# Altium schematic sheet ATMEGA2560-Schematic.SchDoc
size A
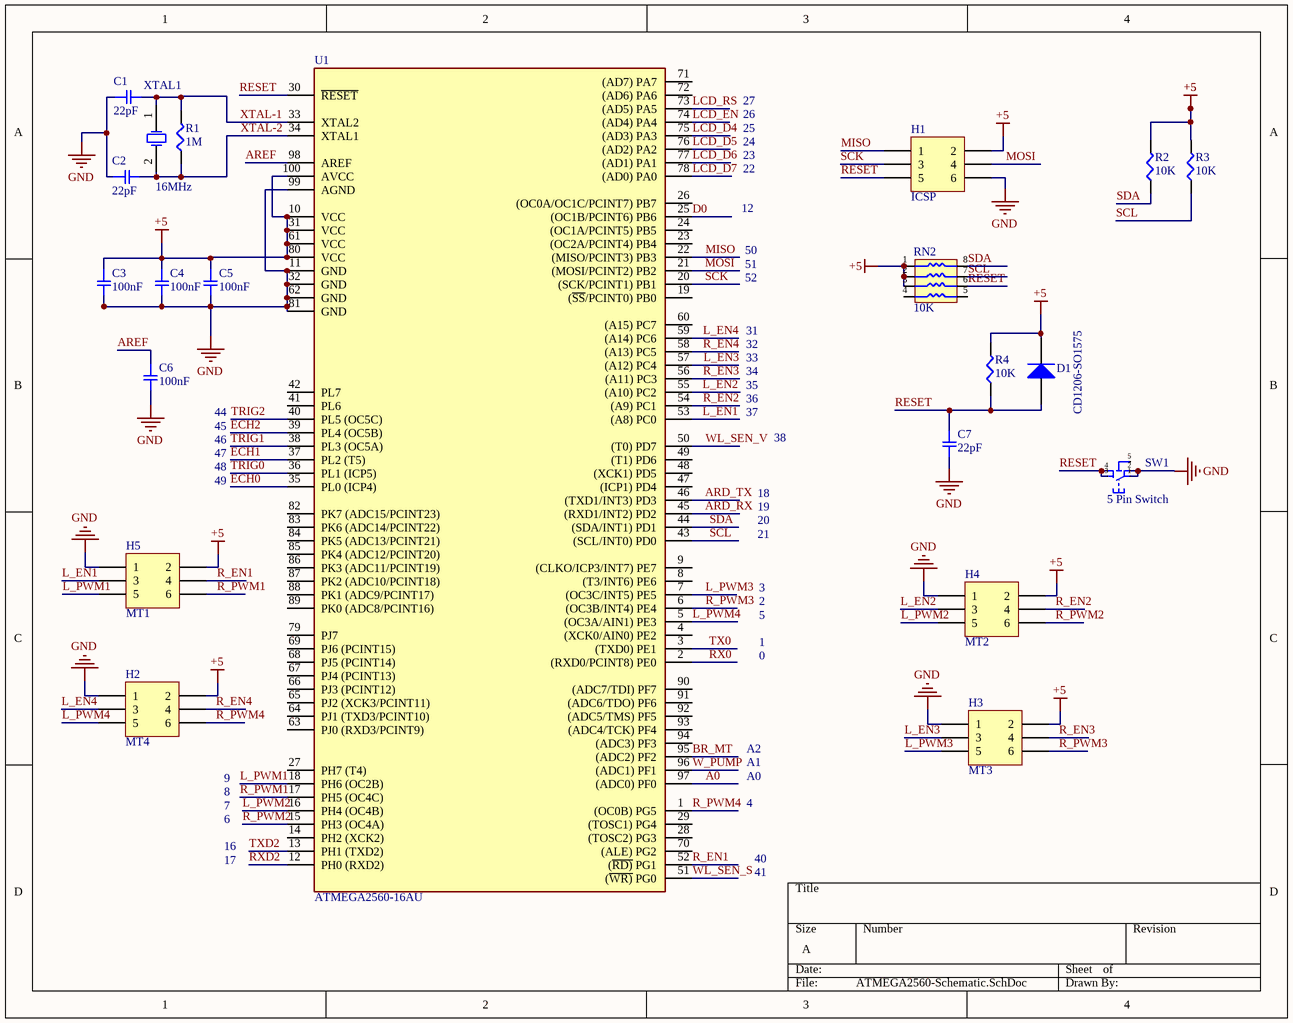
[diagram p0: ATMEGA2560-Schematic.SchDoc]

## Parts
C1  22pF
C2  22pF
C3  100nF  [SMD-0805C]
C4  100nF  [SMD-0805C]
C5  100nF  [SMD-0805C]
C6  100nF  [SMD-0805C]
C7  22pF  [SMD-0603C]
D1  CD1206-SO1575  [D1206-RD]
H1  ICSP  [HDR2X3]
H2  MT4  [HDR2X3]
H3  MT3  [HDR2X3]
H4  MT2  [HDR2X3]
H5  MT1  [HDR2X3]
R1  1M  [SMD-0805-RES]
R2  10K
R3  10K
R4  10K
RN2  10K  [RA0603-8]
SW1  5 Pin Switch  [SPDT-5Pin]
U1  ATMEGA2560-16AU  [TQFP-100(LCSC)]
XTAL1  16MHz

## Nets
+5: C3.1 C4.1 C5.1 D1.2(K) H1.2 H2.2 H3.2 H4.2 H5.2 R2.2 R3.2 R4.2 RN2.1 RN2.2 RN2.3 U1.10(VCC) U1.31(VCC) U1.61(VCC) U1.80(VCC) U1.100(AVCC)
GND: C1.1 C2.1 C3.2 C4.2 C5.2 C6.2 C7.2 H1.6 H2.1 H3.1 H4.1 H5.1 SW1.1 SW1.2 U1.11(GND) U1.32(GND) U1.62(GND) U1.81(GND) U1.99(AGND)
A0: U1.97((ADC0)_PF0)
ARD_RX: U1.45((RXD1/INT2)_PD2)
ARD_TX: U1.46((TXD1/INT3)_PD3)
AREF: C6.1 U1.98(AREF)
BR_MT: U1.95((ADC2)_PF2)
D0: U1.25((OC1B/PCINT6)_PB6)
ECH0: U1.35(PL0_(ICP4))
ECH1: U1.37(PL2_(T5))
ECH2: U1.39(PL4_(OC5B))
L_EN1: H5.3 U1.53((A8)_PC0)
L_EN2: H4.3 U1.55((A10)_PC2)
L_EN3: H3.3 U1.57((A12)_PC4)
L_EN4: H2.3 U1.59((A14)_PC6)
L_PWM1: H5.5 U1.18(PH6_(OC2B))
L_PWM2: H4.5 U1.16(PH4_(OC4B))
L_PWM3: H3.5 U1.7((OC3C/INT5)_PE5)
L_PWM4: H2.5 U1.5((OC3A/AIN1)_PE3)
LCD_D4: U1.75((AD3)_PA3)
LCD_D5: U1.76((AD2)_PA2)
LCD_D6: U1.77((AD1)_PA1)
LCD_D7: U1.78((AD0)_PA0)
LCD_EN: U1.74((AD4)_PA4)
LCD_RS: U1.73((AD5)_PA5)
MISO: H1.1 U1.22((MISO/PCINT3)_PB3)
MOSI: H1.4 U1.21((MOSI/PCINT2)_PB2)
R_EN1: H5.4 U1.52((~{RD)}_PG1)
R_EN2: H4.4 U1.54((A9)_PC1)
R_EN3: H3.4 U1.56((A11)_PC3)
R_EN4: H2.4 U1.58((A13)_PC5)
R_PWM1: H5.6 U1.17(PH5_(OC4C))
R_PWM2: H4.6 U1.15(PH3_(OC4A))
R_PWM3: H3.6 U1.6((OC3B/INT4)_PE4)
R_PWM4: H2.6 U1.1((OC0B)_PG5)
RESET: C7.1 D1.1(A) H1.5 R4.1 RN2.6 SW1.3 SW1.4 U1.30(~{RESET})
RX0: U1.2((RXD0/PCINT8)_PE0)
RXD2: U1.12(PH0_(RXD2))
SCK: H1.3 U1.20((SCK/PCINT1)_PB1)
SCL: R3.1 RN2.7 U1.43((SCL/INT0)_PD0)
SDA: R2.1 RN2.8 U1.44((SDA/INT1)_PD1)
TRIG0: U1.36(PL1_(ICP5))
TRIG1: U1.38(PL3_(OC5A))
TRIG2: U1.40(PL5_(OC5C))
TX0: U1.3((TXD0)_PE1)
TXD2: U1.13(PH1_(TXD2))
W_PUMP: U1.96((ADC1)_PF1)
WL_SEN_S: U1.51((~{WR)}_PG0)
WL_SEN_V: U1.50((T0)_PD7)
XTAL-1: C1.2 R1.2 U1.33(XTAL2) XTAL1.1(OSC1)
XTAL-2: C2.2 R1.1 U1.34(XTAL1) XTAL1.2(OSC2)

Not connected (* = marked no-connect by the designer): RN2 4 5; SW1 5; U1 4((XCK0/AIN0)_PE2) 8((T3/INT6)_PE6) 9((CLKO/ICP3/INT7)_PE7) 14(PH2_(XCK2)) 19((~{SS}/PCINT0)_PB0) 23((OC2A/PCINT4)_PB4) 24((OC1A/PCINT5)_PB5) 26((OC0A/OC1C/PCINT7)_PB7) 27(PH7_(T4)) 28((TOSC2)_PG3) 29((TOSC1)_PG4) 41(PL6) 42(PL7) 47((ICP1)_PD4) 48((XCK1)_PD5) 49((T1)_PD6) 60((A15)_PC7) 63(PJ0_(RXD3/PCINT9)) 64(PJ1_(TXD3/PCINT10)) 65(PJ2_(XCK3/PCINT11)) 66(PJ3_(PCINT12)) 67(PJ4_(PCINT13)) 68(PJ5_(PCINT14)) 69(PJ6_(PCINT15)) 70((ALE)_PG2) 71((AD7)_PA7) 72((AD6)_PA6) 79(PJ7) 82(PK7_(ADC15/PCINT23)) 83(PK6_(ADC14/PCINT22)) 84(PK5_(ADC13/PCINT21)) 85(PK4_(ADC12/PCINT20)) 86(PK3_(ADC11/PCINT19)) 87(PK2_(ADC10/PCINT18)) 88(PK1_(ADC9/PCINT17)) 89(PK0_(ADC8/PCINT16)) 90((ADC7/TDI)_PF7) 91((ADC6/TDO)_PF6) 92((ADC5/TMS)_PF5) 93((ADC4/TCK)_PF4) 94((ADC3)_PF3)

## Notes on the sheet
- 23
- 24
- 25
- 26
- 27
- 12
- 22
- 52
- 51
- 50
- 33
- 32
- 31
- 45
- 44
- 37
- 36
- 35
- 34
- 49
- 48
- 47
- 46
- 18
- 38
- 21
- 20
- 19
- 5
- 2
- 3
- 0
- 1
- A1
- A2
- 6
- 7
- 8
- 9
- 4
- A0
- 17
- 16
- 41
- 40

## Library data of the parts
C1-C7 = GC321AD72E103KX01D: CAP CER 10000PF 250V X7T 0805; Manufacturer: Murata Electronics North America; Factory Stock: 0; Unit Price (USD): 0.3; Minimum Quantity: 1; Tolerance: ±10%; Datasheets: http://search.murata.co.jp/Ceramy/image/img/A01X/G101/ENG/GC321AD72E103KX01-01.pdf; Image: //media.digikey.com/Renders/Murata%20Renders/0805(GC3)200x125.jpg; Digi-Key Part Number: 490-13986-1-ND; Part Number: GC321AD72E103KX01D; Quantity Available: 4000; @ qty: 0; Packaging: Cut Tape (CT); Series: GC3; Part Status: Active; Value: 10000pF; Voltage: 250V; Temperature Coefficient: X7T; Operating Temperature: -55°C ~ 125°C; Features: -; Ratings: AEC-Q200; Applications: Automotive; Mounting Type: Surface Mount, MLCC; Package / Case: 0805 (2012 Metric); Size / Dimension: 0.079" L x 0.049" W (2.00mm x 1.25mm); Height - Seated (Max): -; Thickness (Max): 0.039" (1.00mm); Lead Spacing: -; Lead Style: -
D1 = Diode: Default Diode; Published: 8-Jun-2000; LatestRevisionDate: 17-Jul-2002; LatestRevisionNote: Re-released for DXP Platform.; PackageVersion: Sep-1996; PackageReference: SMC; Publisher: Altium Limited; PackageDescription: DO-214-AB/SMC; 2 C-Bend Leads; Body 7.9 x 5.9 mm, inc. leads (LxW); Code_JEDEC: DO-214-AB
H1-H5 = Header 3X2: Header, 3-Pin, Dual row; LatestRevisionDate: 17-Jul-2002; LatestRevisionNote: Re-released for DXP Platform.; Publisher: Altium Limited
R1-R4 = ERJ-6BQF1R1V: RES SMD 1.1 OHM 1% 1/3W 0805; Manufacturer: Panasonic Electronic Components; Factory Stock: 0; Unit Price (USD): 0.05834; @ qty: 1500; Minimum Quantity: 1; Value: 1.1; Power (Watts): 0.333W, 1/3W; Temperature Coefficient: ±200ppm/°C; Part Number: ERJ-6BQF1R1V; Datasheets: https://industrial.panasonic.com/cdbs/www-data/pdf/RDA0000/AOA0000C239.pdf; Image: //media.digikey.com/Renders/Panasonic%20Renders/ERJ-0805%20Pkg.jpg; Digi-Key Part Number: P17500CT-ND; Quantity Available: 34000; Packaging: Cut Tape (CT); Series: ERJ; Part Status: Active; Tolerance: ±1%; Composition: Thick Film; Features: Automotive AEC-Q200, Current Sense; Operating Temperature: -55°C ~ 125°C; Package / Case: 0805 (2012 Metric); Supplier Device Package: 0805; Size / Dimension: 0.079" L x 0.049" W (2.00mm x 1.25mm); Height - Seated (Max): 0.028" (0.70mm); Number of Terminations: 2; Failure Rate: -
RN2 = RES_NETWORK: 330 Ohm Â±5% 62.5mW Power Per Element Isolated Resistor Network/Array Â±200ppm/Â°C 1206 _3216 Metric_, Convex, Long Side Terminals; MF: Yageo; MP: YC164-JR-07330RL; Price: None; Availability: Unavailable; SnapEDA_Link: https://www.snapeda.com/parts/YC164-JR-07330RL/Yageo/view-part/106017/?ref=snap; Value: *; Package: 1206 Yageo
SW1 = SPDT-SWITCH
U1 = ATMEGA2560-16AU (LCSC): Integrated Circuit; Manufacturer_Name: Microchip; Height: 1.2mm; Manufacturer_Part_Number: ATMEGA2560-16AU
XTAL1 = Crystal Oscillator: Published: 8-Jun-2000; LatestRevisionDate: 17-Jul-2002; LatestRevisionNote: Re-released for DXP Platform.; PackageReference: R38; Publisher: Altium Limited; PackageDescription: Crystal, Thru-Hole; 2 Leads; Body 3.1 x 8.2 mm (Dia.xH)